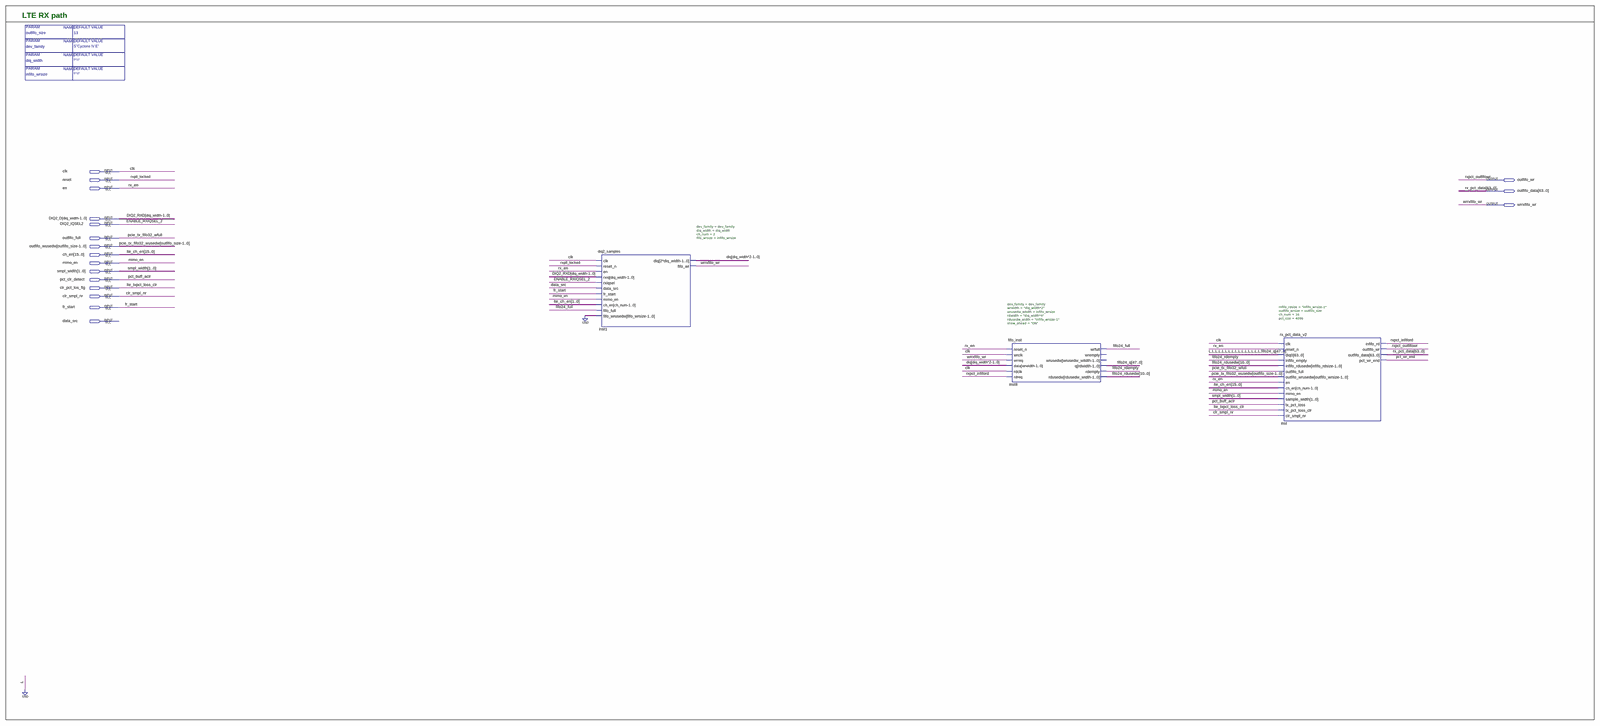
[diagram p0: schematic sheet, whole]
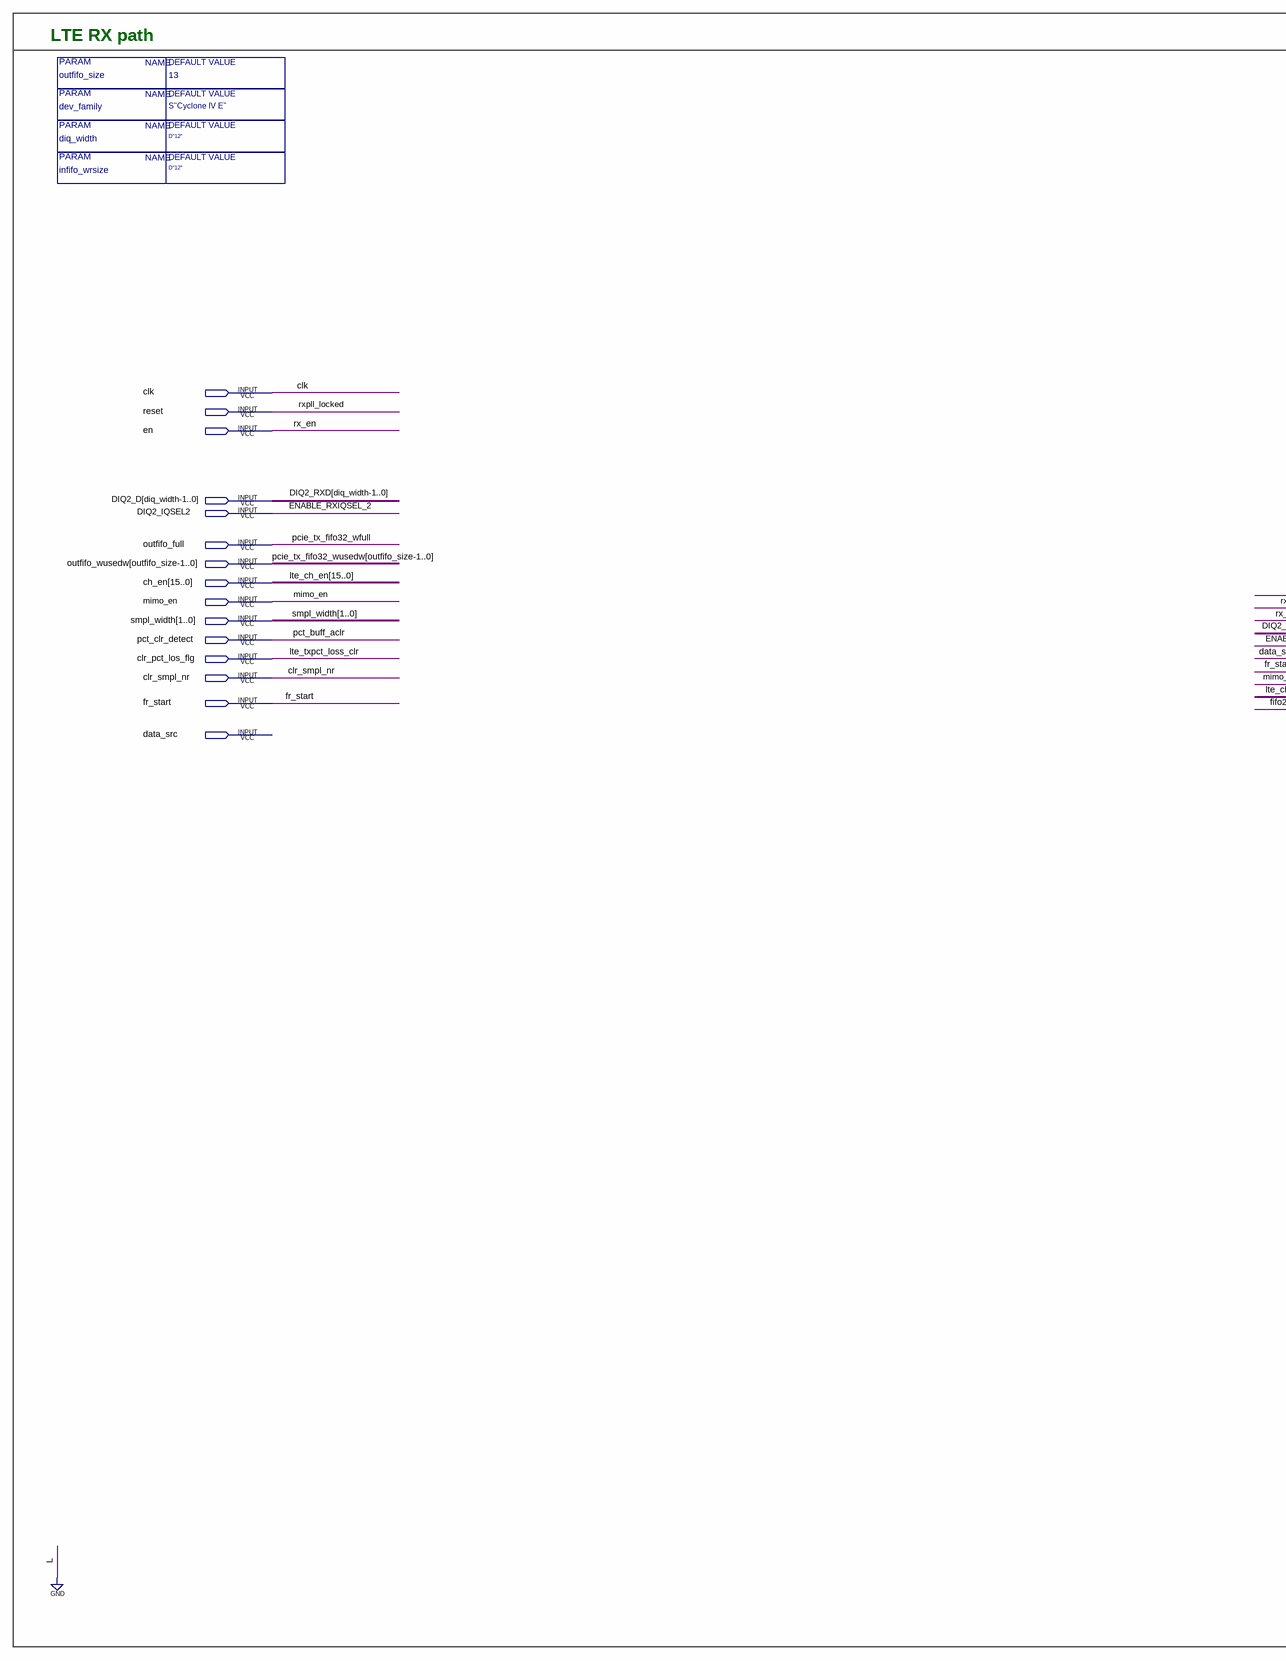
[diagram p1: schematic sheet, left part]
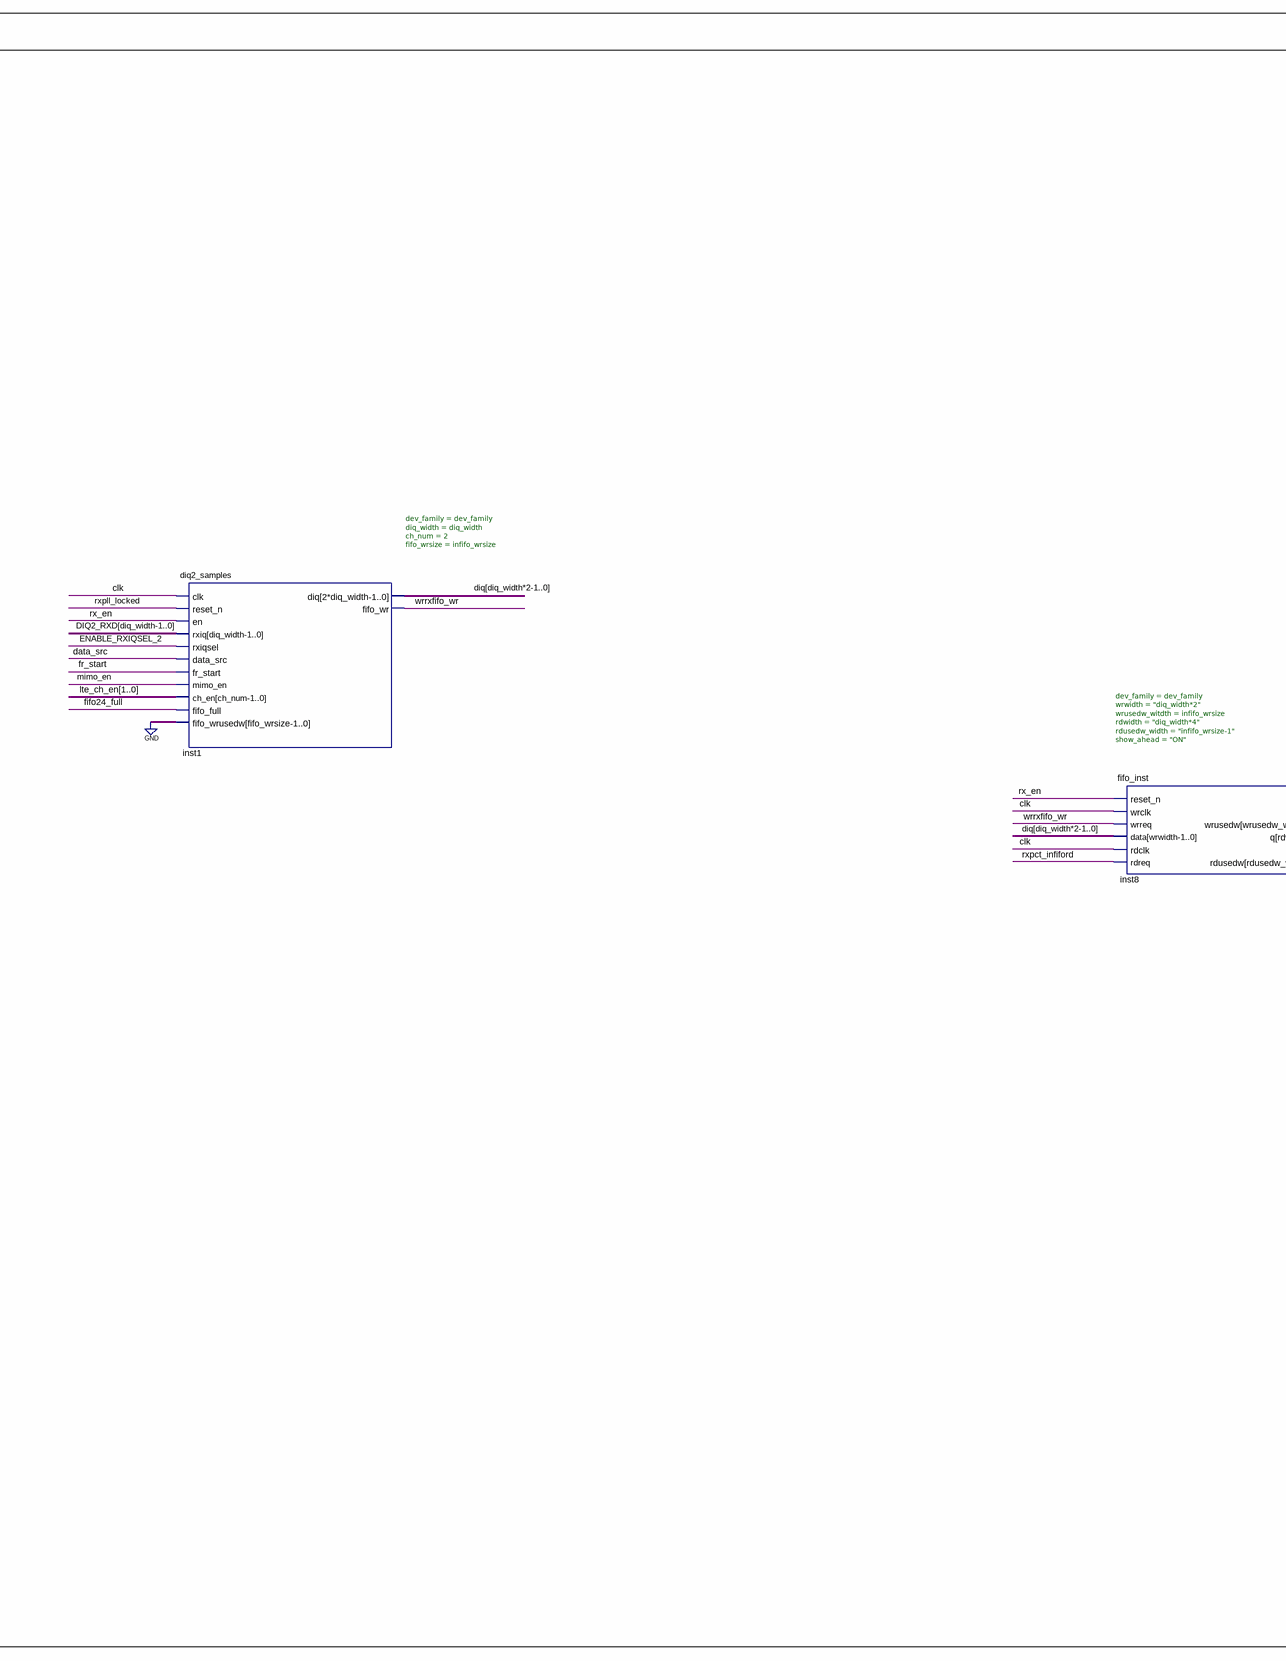
[diagram p2: schematic sheet, centre part]
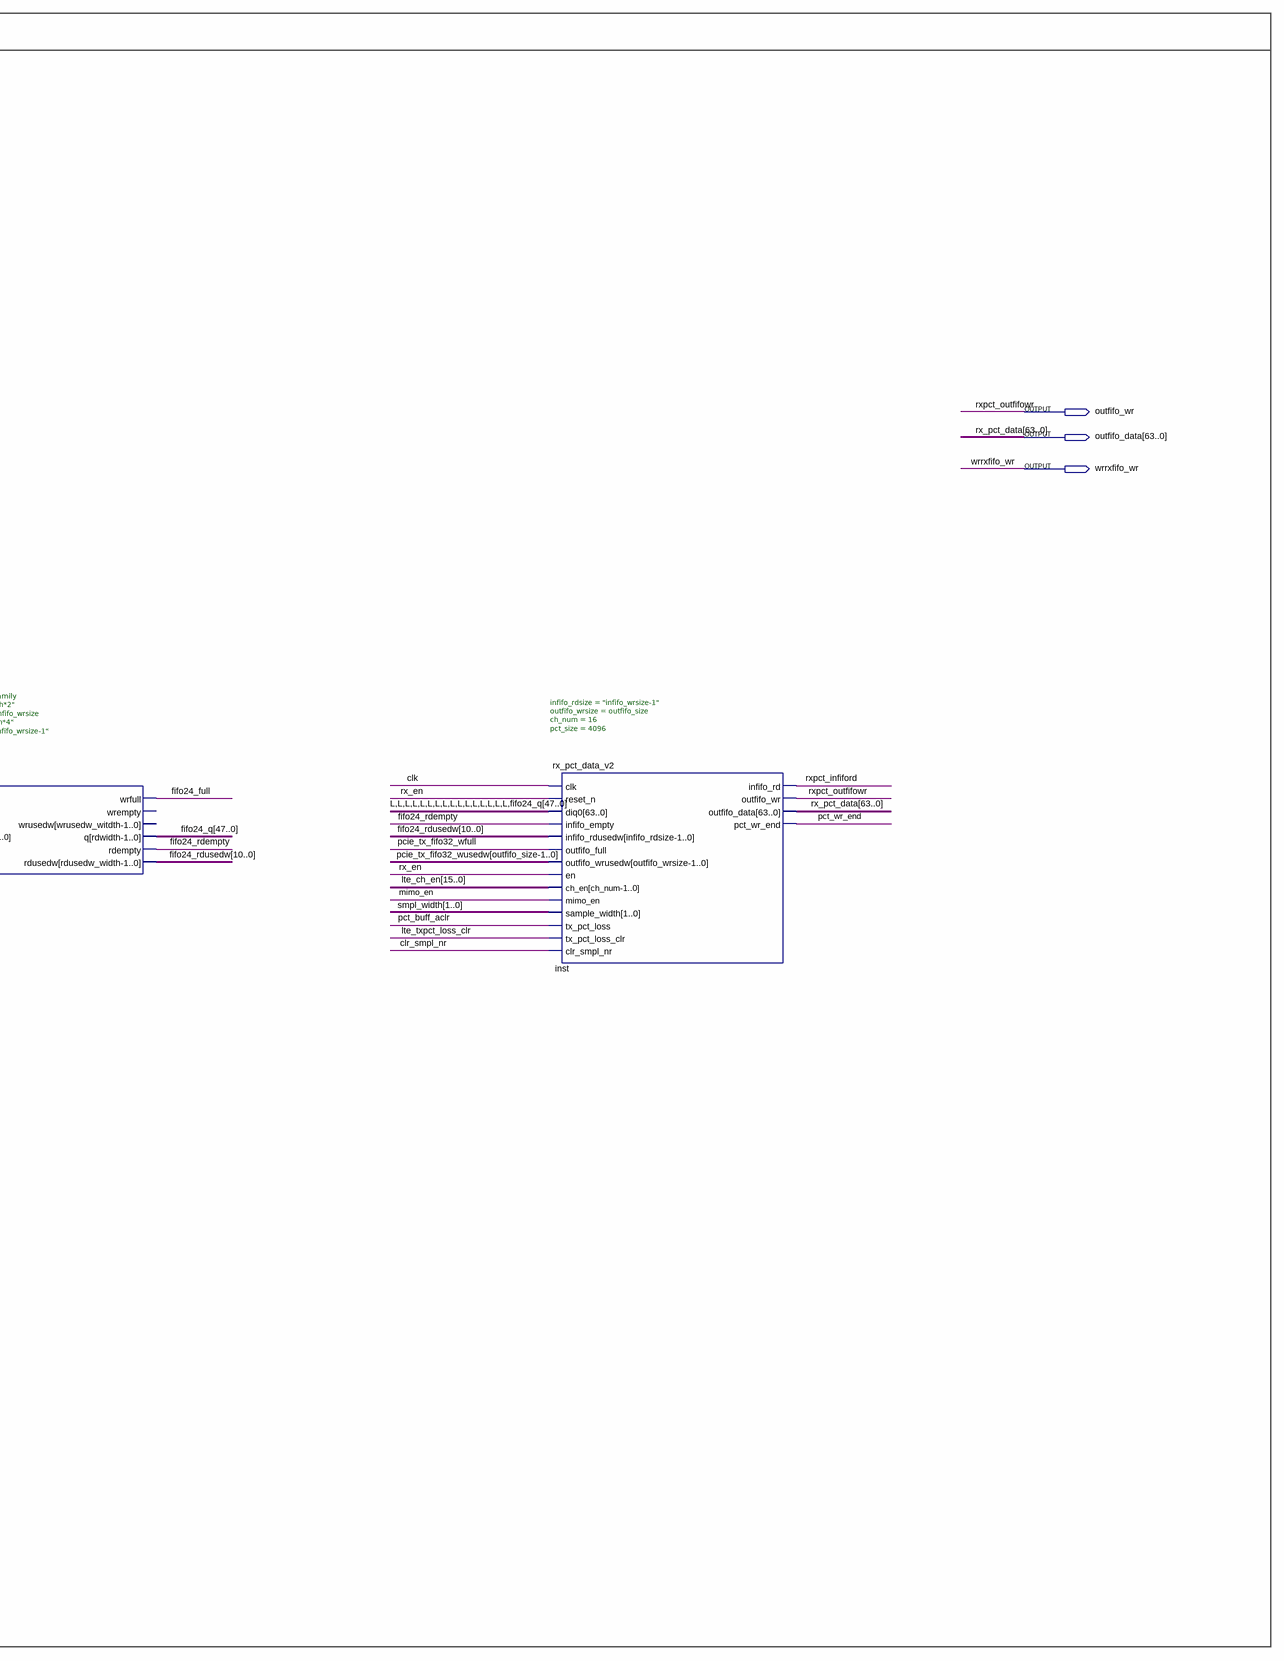
[diagram p3: schematic sheet, right part]
// Quartus schematic LTE_rx_path.bdf as structural Verilog: 3 symbols, 18 pins
module LTE_rx_path #(parameter outfifo_size = 13, parameter dev_family = "S\"Cyclone IV E\"", parameter diq_width = "D\"12\"", parameter infifo_wrsize = "D\"12\"") (
  input  clk,
  input  reset,
  input  en,
  input  \DIQ2_D[diq_width-1..0] ,
  input  DIQ2_IQSEL2,
  input  outfifo_full,
  input  [12:0] outfifo_wusedw,
  input  [15:0] ch_en,
  input  mimo_en,
  input  [1:0] smpl_width,
  input  pct_clr_detect,
  input  clr_pct_los_flg,
  input  clr_smpl_nr,
  input  fr_start,
  input  data_src,
  output outfifo_wr,
  output [63:0] outfifo_data,
  output wrrxfifo_wr
);

  wire \diq[diq_width*2-1..0] , fifo24_full, fifo24_rdempty, pct_wr_end, rxpct_infiford;
  wire [10:0] fifo24_rdusedw;
  wire [47:0] fifo24_q;

  diq2_samples #(.dev_family(dev_family), .diq_width(diq_width), .ch_num(2), .fifo_wrsize(infifo_wrsize)) inst1 (
    .clk(clk), .reset_n(reset), .en(en), .rxiq(\DIQ2_D[diq_width-1..0] ), .rxiqsel(DIQ2_IQSEL2),
    .data_src(data_src), .fr_start(fr_start), .mimo_en(mimo_en), .ch_en(ch_en[1:0]), .fifo_full(fifo24_full),
    .fifo_wrusedw(1'b0), .diq(\diq[diq_width*2-1..0] ), .fifo_wr(wrrxfifo_wr));
  fifo_inst #(.dev_family(dev_family), .wrwidth("diq_width*2"), .wrusedw_witdth(infifo_wrsize), .rdwidth("diq_width*4"), .rdusedw_width("infifo_wrsize-1"), .show_ahead("ON")) inst8 (
    .reset_n(en), .wrclk(clk), .wrreq(wrrxfifo_wr), .data(\diq[diq_width*2-1..0] ), .rdclk(clk),
    .rdreq(rxpct_infiford), .wrfull(fifo24_full), .q(fifo24_q), .rdempty(fifo24_rdempty),
    .rdusedw(fifo24_rdusedw));  // open: wrempty, wrusedw
  rx_pct_data_v2 #(.infifo_rdsize("infifo_wrsize-1"), .outfifo_wrsize(outfifo_size), .ch_num(16), .pct_size(4096)) inst (
    .clk(clk), .reset_n(en), .diq0({{16{1'b0}}, fifo24_q}), .infifo_empty(fifo24_rdempty),
    .infifo_rdusedw(fifo24_rdusedw), .outfifo_full(outfifo_full), .outfifo_wrusedw(outfifo_wusedw), .en(en),
    .ch_en(ch_en), .mimo_en(mimo_en), .sample_width(smpl_width), .tx_pct_loss(pct_clr_detect),
    .tx_pct_loss_clr(clr_pct_los_flg), .clr_smpl_nr(clr_smpl_nr), .infifo_rd(rxpct_infiford),
    .outfifo_wr(outfifo_wr), .outfifo_data(outfifo_data), .pct_wr_end(pct_wr_end));

  // Other names for the same wires on the sheet: DIQ2_RXD[diq_width-1..0] = \DIQ2_D[diq_width-1..0] ;
  //   ENABLE_RXIQSEL_2 = DIQ2_IQSEL2; lte_ch_en[15:0] = ch_en; lte_txpct_loss_clr = clr_pct_los_flg;
  //   pcie_tx_fifo32_wfull = outfifo_full; pcie_tx_fifo32_wusedw[12:0] = outfifo_wusedw;
  //   pct_buff_aclr = pct_clr_detect; rx_en = en; rx_pct_data[63:0] = outfifo_data; rxpct_outfifowr = outfifo_wr;
  //   rxpll_locked = reset

  // Notes on the sheet:
  //   LTE RX path
endmodule
